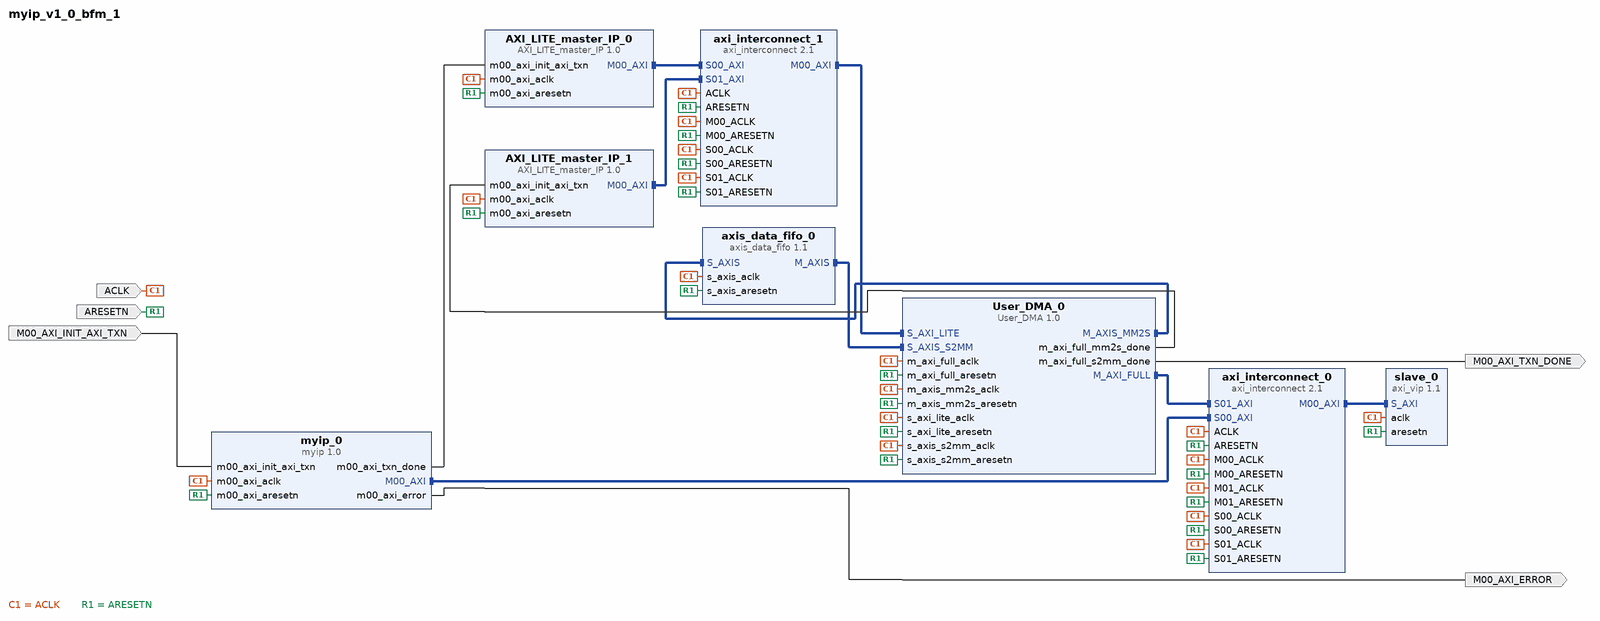
[diagram p0: block diagram of the top level]
# Vivado block design myip_v1_0_bfm_1, xc7z010clg400-1, Vivado 2017.4
create_bd_design myip_v1_0_bfm_1

create_bd_port -dir I -type clk ACLK
set_property -dict [list \
  CONFIG.FREQ_HZ 100000000 \
  CONFIG.PHASE 0.000 \
  CONFIG.CLK_DOMAIN myip_v1_0_bfm_1_ACLK \
  CONFIG.ASSOCIATED_RESET ARESETN \
] [get_bd_ports ACLK]
create_bd_port -dir I -type rst ARESETN
set_property -dict {CONFIG.POLARITY ACTIVE_LOW} [get_bd_ports ARESETN]
create_bd_port -dir I M00_AXI_INIT_AXI_TXN
create_bd_port -dir O M00_AXI_ERROR
create_bd_port -dir O M00_AXI_TXN_DONE

create_bd_cell -type ip -vlnv xilinx.com:ip:axi_vip:1.1 slave_0
set_property -dict {CONFIG.PROTOCOL AXI4 CONFIG.INTERFACE_MODE SLAVE} [get_bd_cells slave_0]
create_bd_cell -type ip -vlnv xilinx.com:user:myip:1.0 myip_0
set_property -dict {CONFIG.C_M00_AXI_TARGET_SLAVE_BASE_ADDR 0x44A00000} [get_bd_cells myip_0]
create_bd_cell -type ip -vlnv xilinx.com:ip:axi_interconnect:2.1 axi_interconnect_0
set_property -dict {CONFIG.NUM_SI 2 CONFIG.NUM_MI 2} [get_bd_cells axi_interconnect_0]
create_bd_cell -type ip -vlnv xilinx.com:ip:axis_data_fifo:1.1 axis_data_fifo_0
create_bd_cell -type ip -vlnv xilinx.com:user:AXI_LITE_master_IP:1.0 AXI_LITE_master_IP_0
set_property -dict [list \
  CONFIG.C_M00_AXI_START_DATA_VALUE 0x00000000 \
  CONFIG.C_M00_AXI_TARGET_SLAVE_BASE_ADDR 0x44A10000 \
  CONFIG.REG_DATA_VALUE_2 0x44A00000 \
  CONFIG.REG_DATA_VALUE_3 0xFF00006F \
] [get_bd_cells AXI_LITE_master_IP_0]
create_bd_cell -type ip -vlnv xilinx.com:user:AXI_LITE_master_IP:1.0 AXI_LITE_master_IP_1
set_property -dict [list \
  CONFIG.C_M00_AXI_START_DATA_VALUE 0x00000000 \
  CONFIG.C_M00_AXI_TARGET_SLAVE_BASE_ADDR 0x44A10000 \
  CONFIG.REG_DATA_VALUE_0 0x44A01000 \
  CONFIG.REG_DATA_VALUE_1 0xFF00006F \
] [get_bd_cells AXI_LITE_master_IP_1]
create_bd_cell -type ip -vlnv xilinx.com:ip:axi_interconnect:2.1 axi_interconnect_1
set_property -dict {CONFIG.NUM_SI 2 CONFIG.NUM_MI 1} [get_bd_cells axi_interconnect_1]
create_bd_cell -type ip -vlnv user.org:user:User_DMA:1.0 User_DMA_0

# ---- connections ----

connect_bd_intf_net [get_bd_intf_pins axi_interconnect_0/M00_AXI] [get_bd_intf_pins slave_0/S_AXI]
connect_bd_intf_net [get_bd_intf_pins myip_0/M00_AXI] [get_bd_intf_pins axi_interconnect_0/S00_AXI]
connect_bd_intf_net [get_bd_intf_pins User_DMA_0/M_AXI_FULL] [get_bd_intf_pins axi_interconnect_0/S01_AXI]
connect_bd_intf_net [get_bd_intf_pins axis_data_fifo_0/M_AXIS] [get_bd_intf_pins User_DMA_0/S_AXIS_S2MM]
connect_bd_intf_net [get_bd_intf_pins User_DMA_0/M_AXIS_MM2S] [get_bd_intf_pins axis_data_fifo_0/S_AXIS]
connect_bd_intf_net [get_bd_intf_pins axi_interconnect_1/M00_AXI] [get_bd_intf_pins User_DMA_0/S_AXI_LITE]
connect_bd_intf_net [get_bd_intf_pins AXI_LITE_master_IP_1/M00_AXI] [get_bd_intf_pins axi_interconnect_1/S01_AXI]
connect_bd_intf_net [get_bd_intf_pins AXI_LITE_master_IP_0/M00_AXI] [get_bd_intf_pins axi_interconnect_1/S00_AXI]
connect_bd_net -net aclk_net [get_bd_ports ACLK] \
  [get_bd_pins slave_0/aclk] [get_bd_pins myip_0/m00_axi_aclk] [get_bd_pins axis_data_fifo_0/s_axis_aclk] \
  [get_bd_pins AXI_LITE_master_IP_0/m00_axi_aclk] [get_bd_pins AXI_LITE_master_IP_1/m00_axi_aclk] \
  [get_bd_pins User_DMA_0/s_axi_lite_aclk] [get_bd_pins User_DMA_0/s_axis_s2mm_aclk] [get_bd_pins User_DMA_0/m_axi_full_aclk] \
  [get_bd_pins User_DMA_0/m_axis_mm2s_aclk] [get_bd_pins axi_interconnect_0/S00_ACLK] \
  [get_bd_pins axi_interconnect_0/M01_ACLK] [get_bd_pins axi_interconnect_0/ACLK] [get_bd_pins axi_interconnect_0/S01_ACLK] \
  [get_bd_pins axi_interconnect_0/M00_ACLK] [get_bd_pins axi_interconnect_1/S01_ACLK] [get_bd_pins axi_interconnect_1/ACLK] \
  [get_bd_pins axi_interconnect_1/S00_ACLK] [get_bd_pins axi_interconnect_1/M00_ACLK]
connect_bd_net -net aresetn_net [get_bd_ports ARESETN] \
  [get_bd_pins slave_0/aresetn] [get_bd_pins myip_0/m00_axi_aresetn] [get_bd_pins axis_data_fifo_0/s_axis_aresetn] \
  [get_bd_pins AXI_LITE_master_IP_0/m00_axi_aresetn] [get_bd_pins AXI_LITE_master_IP_1/m00_axi_aresetn] \
  [get_bd_pins User_DMA_0/s_axi_lite_aresetn] [get_bd_pins User_DMA_0/s_axis_s2mm_aresetn] \
  [get_bd_pins User_DMA_0/m_axi_full_aresetn] [get_bd_pins User_DMA_0/m_axis_mm2s_aresetn] \
  [get_bd_pins axi_interconnect_0/S00_ARESETN] [get_bd_pins axi_interconnect_0/M01_ARESETN] \
  [get_bd_pins axi_interconnect_0/ARESETN] [get_bd_pins axi_interconnect_0/S01_ARESETN] \
  [get_bd_pins axi_interconnect_0/M00_ARESETN] [get_bd_pins axi_interconnect_1/S01_ARESETN] \
  [get_bd_pins axi_interconnect_1/ARESETN] [get_bd_pins axi_interconnect_1/S00_ARESETN] \
  [get_bd_pins axi_interconnect_1/M00_ARESETN]
connect_bd_net -net init_axi_txn_00 [get_bd_ports M00_AXI_INIT_AXI_TXN] [get_bd_pins myip_0/m00_axi_init_axi_txn]
connect_bd_net -net txn_done_00 [get_bd_pins myip_0/m00_axi_txn_done] [get_bd_pins AXI_LITE_master_IP_0/m00_axi_init_axi_txn]
connect_bd_net -net error_00 [get_bd_pins myip_0/m00_axi_error] [get_bd_ports M00_AXI_ERROR]
connect_bd_net [get_bd_pins User_DMA_0/m_axi_full_mm2s_done] [get_bd_pins AXI_LITE_master_IP_1/m00_axi_init_axi_txn]
connect_bd_net [get_bd_pins User_DMA_0/m_axi_full_s2mm_done] [get_bd_ports M00_AXI_TXN_DONE]

# ---- address map ----
assign_bd_address -offset 0x44A10000 -range 64K -target_address_space [get_bd_addr_spaces AXI_LITE_master_IP_0/M00_AXI] [get_bd_addr_segs User_DMA_0/S_AXI_LITE/S_AXI_LITE_reg]
assign_bd_address -offset 0x44A10000 -range 64K -target_address_space [get_bd_addr_spaces AXI_LITE_master_IP_1/M00_AXI] [get_bd_addr_segs User_DMA_0/S_AXI_LITE/S_AXI_LITE_reg]
assign_bd_address -offset 0x44A00000 -range 64K -target_address_space [get_bd_addr_spaces myip_0/M00_AXI] [get_bd_addr_segs slave_0/S_AXI/Reg]
assign_bd_address -offset 0x44A10000 -range 64K -target_address_space [get_bd_addr_spaces myip_0/M00_AXI] [get_bd_addr_segs User_DMA_0/S_AXI_LITE/S_AXI_LITE_reg]
assign_bd_address -offset 0x44A00000 -range 64K -target_address_space [get_bd_addr_spaces User_DMA_0/M_AXI_FULL] [get_bd_addr_segs slave_0/S_AXI/Reg]

validate_bd_design
save_bd_design
